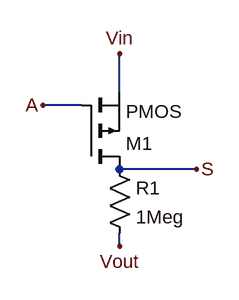
[diagram p0: schematic PNOT.asc]
PNOT.asc, the LTspice schematic file:
Version 4
SHEET 1 880 680
WIRE 224 112 224 64
WIRE 176 128 128 128
WIRE 320 208 224 208
WIRE 224 304 224 288
FLAG 128 128 A
FLAG 224 64 Vin
FLAG 320 208 S
FLAG 224 304 Vout
SYMBOL pmos 176 208 M180
SYMATTR InstName M1
SYMBOL res 208 192 R0
SYMATTR InstName R1
SYMATTR Value 1Meg
SYMATTR SpiceLine tol=1 pwr=0.1

The netlist it stands for:
* PNOT.asc
M1 S A Vin Vin PMOS
R1 S Vout 1Meg tol=1 pwr=0.1
.model NMOS NMOS
.model PMOS PMOS
.lib standard.mos
.backanno
.end